# Altium schematic sheet 3_RKSTM32_Peripheral.SchDoc
size A4; SheetNumber: 4; SheetTotal: 4
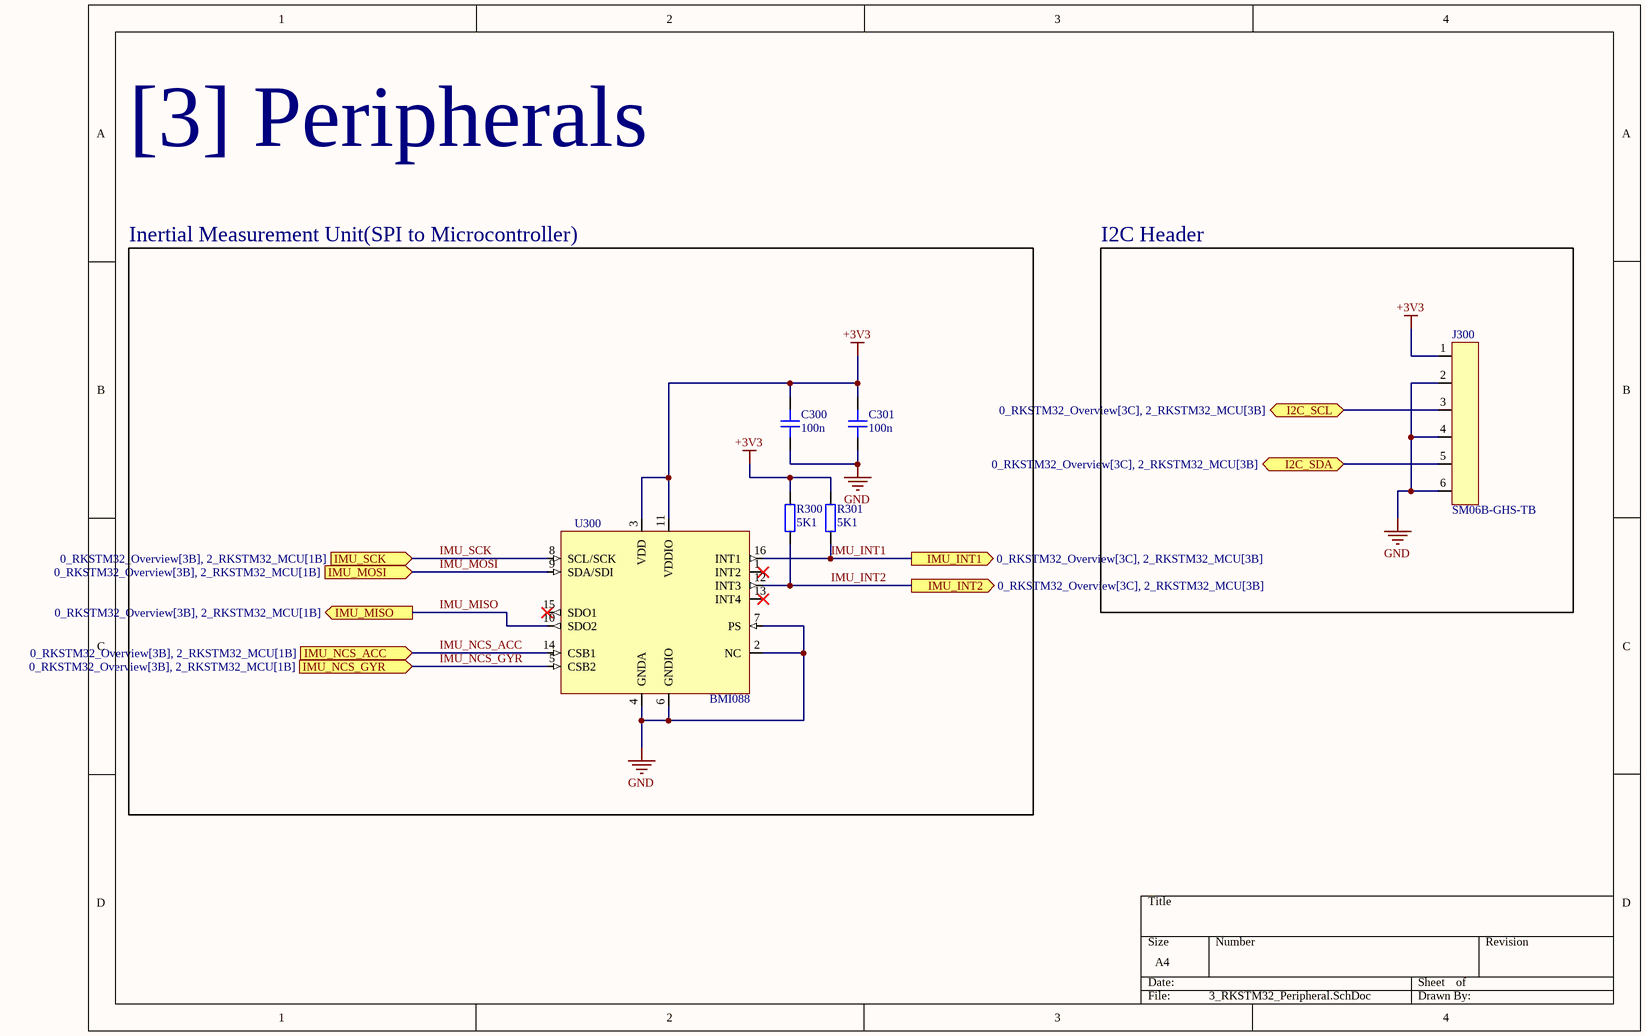
[diagram p0: 3_RKSTM32_Peripheral.SchDoc]

## Parts
C300  100n  [CAP_0805]
C301  100n  [CAP_0805]
J300  SM06B-GHS-TB  [SM06B-GHS-TB]
R300  5K1  [RES_0603]
R301  5K1  [RES_0603]
U300  BMI088  [BMI088]

## Blocks framed on the sheet
Inertial Measurement Unit(SPI to Microcontroller): C300 C301 R300 R301 U300
I2C Header: J300

## Ports
I2C_SCL (bidir, see 0_RKSTM32_Overview[3C], 2_RKSTM32_MCU[3B]), I2C_SDA (bidir, see 0_RKSTM32_Overview[3C], 2_RKSTM32_MCU[3B]), IMU_INT1 (out, see 0_RKSTM32_Overview[3C], 2_RKSTM32_MCU[3B]), IMU_INT2 (out, see 0_RKSTM32_Overview[3C], 2_RKSTM32_MCU[3B]), IMU_MISO (out, see 0_RKSTM32_Overview[3B], 2_RKSTM32_MCU[1B]), IMU_MOSI (in, see 0_RKSTM32_Overview[3B], 2_RKSTM32_MCU[1B]), IMU_NCS_ACC (in, see 0_RKSTM32_Overview[3B], 2_RKSTM32_MCU[1B]), IMU_NCS_GYR (in, see 0_RKSTM32_Overview[3B], 2_RKSTM32_MCU[1B]), IMU_SCK (in, see 0_RKSTM32_Overview[3B], 2_RKSTM32_MCU[1B])

## Nets
+3V3: C300.2 C301.2 J300.1 R300.2 R301.2 U300.3(VDD) U300.11(VDDIO)
GND: C300.1 C301.1 J300.2 J300.4 J300.6 U300.2(NC) U300.4(GNDA) U300.6(GNDIO) U300.7(PS)
I2C_SCL: J300.3 ; port I2C_SCL
I2C_SDA: J300.5 ; port I2C_SDA
IMU_INT1: R301.1 U300.16(INT1) ; port IMU_INT1
IMU_INT2: R300.1 U300.12(INT3) ; port IMU_INT2
IMU_MISO: U300.10(SDO2) ; port IMU_MISO
IMU_MOSI: U300.9(SDA/SDI) ; port IMU_MOSI
IMU_NCS_ACC: U300.14(CSB1) ; port IMU_NCS_ACC
IMU_NCS_GYR: U300.5(CSB2) ; port IMU_NCS_GYR
IMU_SCK: U300.8(SCL/SCK) ; port IMU_SCK

Not connected (* = marked no-connect by the designer): U300 1(INT2)* 13(INT4)* 15(SDO1)*

## Notes on the sheet
- [3] Peripherals

## Library data of the parts
C300 C301 = CAP_0805: Capacitor SMD 0805; Manufacturer: *; Manufacturer Part Number: *; Distributor Link: *; LCSC: *; Rating: *; Dielectric: *
J300 = SM06B-GHS-TB: Header Connector 6 Position 1.25MM Pitch SMD Horizontal JST GH; Manufacturer: JST; Manufacturer Part Number: SM06B-GHS-TB
R300 R301 = RES_0603: Resistor SMD 0603; Manufacturer: *; Manufacturer Part Number: *; Distributor Link: *; LCSC: *
U300 = BMI088: Inertial Measurement Unit IMU 6-Axis LGA; Manufacturer: Bosch; Manufacturer Part Number: BMI088